# EAGLE design SV60mAHelleLEDs (EAGLE 6.5.0)
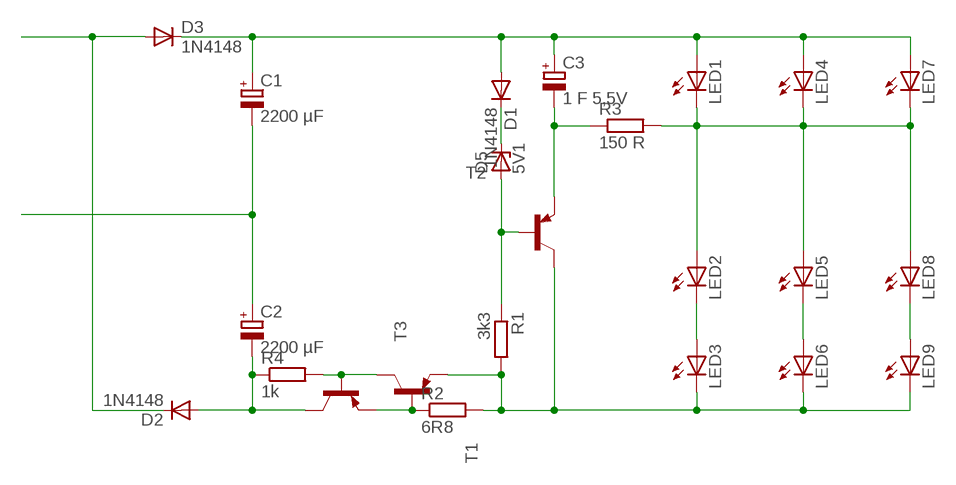
[diagram p0: schematic, sheet 1]

## Parts
C1  2200 µF  CPOL-EUE5-10.5  [E5-10,5]
C2  2200 µF  CPOL-EUE5-10.5  [E5-10,5]
C3  1 F 5,5V  CPOL-EUE3.5-10  [E3,5-10]
D1  1N4148  1N4148DO35-10  [DO35-10]
D2  1N4148  1N4148DO35-10  [DO35-10]
D3  1N4148  1N4148DO35-10  [DO35-10]
D5  5V1  BZD23  [SOD81]
LED1  LED5MM  [LED5MM]
LED2  LED5MM  [LED5MM]
LED3  LED5MM  [LED5MM]
LED4  LED5MM  [LED5MM]
LED5  LED5MM  [LED5MM]
LED6  LED5MM  [LED5MM]
LED7  LED5MM  [LED5MM]
LED8  LED5MM  [LED5MM]
LED9  LED5MM  [LED5MM]
R1  3k3  R-EU_0207/10  [0207/10]
R2  6R8  R-EU_0207/10  [0207/10]
R3  150 R  R-EU_0207/10  [0207/10]
R4  1k  R-EU_0207/10  [0207/10]
T1  2N2907-PNP-TO18-EBC  [TO18]
T2  2N2907-PNP-TO18-EBC  [TO18]
T3  2N2907-PNP-TO18-EBC  [TO18]

## Nets
D1: D2.C D3.A
D2: C1.- C2.+
LV2: LED3.K(C) LED6.K(C) LED9.K(C) R1.2 R2.2 T1.1(E) T2.3(C)
N$1: C1.+ C3.+ D1.A D3.C LED1.A LED4.A LED7.A
N$2: C2.- D2.A R4.1 T3.3(C)
N$3: R2.1 T1.2(B) T3.1(E)
N$4: R4.2 T1.3(C) T3.2(B)
N$5: D5.A R1.1 T2.2(B)
N$6: D1.C D5.C
N$7: C3.- R3.1 T2.1(E)
N$9: LED5.K(C) LED6.A
N$10: LED1.K(C) LED2.A LED4.K(C) LED5.A LED7.K(C) LED8.A R3.2
N$11: LED2.K(C) LED3.A
N$16: LED8.K(C) LED9.A

## Library data of the parts
C1-C3 = rcl:CPOL-EU: POLARIZED CAPACITOR, European symbol
D1-D3 = diode:1N4148: DIODE high speed (Philips)
D5 = diode:BZD23: Z DIODE
LED1-LED9 = led:LED: LED OSRAM: - CHIPLED LG R971, LG N971, LY N971, LG Q971, LY Q971, LO R971, LY R971 LH N974, LH R974 LS Q976, LO Q976, LY Q976 LO Q996 - Hyper CHIPLED LW Q18S LB Q993, LB Q99A, LB R99A - SideLED LS A670, LO A670, LY A670, LG A670, LP A670 LB A673, LV A673, LT A673, LW A673 LH A674 LY A675 LS A676, LA A676, LO A676, LY A676, LW A676 LS A679, LY A679, LG A679 - Hyper Micro SIDELED® LS Y876, LA Y876, LO Y876, LY Y876 LT Y87S - SmartLED LW L88C, LW L88S LB L89C, LB L89S, LG L890 LS L89K, LO L89K, LY L89K LS L896, LA L896, LO L896, LY L896 - TOPLED LS T670, LO T670, LY T670, LG T670, LP T670 LSG T670, LSP T670, LSY T670, LOP T670, LYG T670 LG T671, LOG T671, LSG T671 LB T673, LV T673, LT T673, LW T673 LH T674 LS T676, LA T676, LO T676, LY T676, LB T676, LH T676, LSB T676, LW T676 LB T67C, LV T67C, LT T67C, LS T67K, LO T67K, LY T67K, LW E67C LS E67B, LA E67B, LO E67B, LY E67B, LB E67C, LV E67C, LT E67C LW T67C LS T679, LY T679, LG T679 LS T770, LO T770, LY T770, LG T770, LP T770 LB T773, LV T773, LT T773, LW T773 LH T774 LS E675, LA E675, LY E675, LS T675 LS T776, LA T776, LO T776, LY T776, LB T776 LHGB T686 LT T68C, LB T68C - Hyper Mini TOPLED® LB M676 - Mini TOPLED Santana® LG M470 LS M47K, LO M47K, LY M47K Source: http://www.osram.convergy.de LUXEON: - LUMILED® LXK2-PW12-R00, LXK2-PW12-S00, LXK2-PW14-U00, LXK2-PW14-V00 LXK2-PM12-R00, LXK2-PM12-S00, LXK2-PM14-U00 LXK2-PE12-Q00, LXK2-PE12-R00, LXK2-PE12-S00, LXK2-PE14-T00, LXK2-PE14-U00 LXK2-PB12-K00, LXK2-PB12-L00, LXK2-PB12-M00, LXK2-PB14-N00, LXK2-PB14-P00, LXK2-PB14-Q00 LXK2-PR12-L00, LXK2-PR12-M00, LXK2-PR14-Q00, LXK2-PR14-R00 LXK2-PD12-Q00, LXK2-PD12-R00, LXK2-PD12-S00 LXK2-PH12-R00, LXK2-PH12-S00 LXK2-PL12-P00, LXK2-PL12-Q00, LXK2-PL12-R00 Source: www.luxeon.com KINGBRIGHT: KA-3528ASYC Source: www.kingbright.com
R1-R4 = rcl:R-EU_: RESISTOR, European symbol
T1-T3 = transistor:*-PNP-: PNP Transistror

## Board
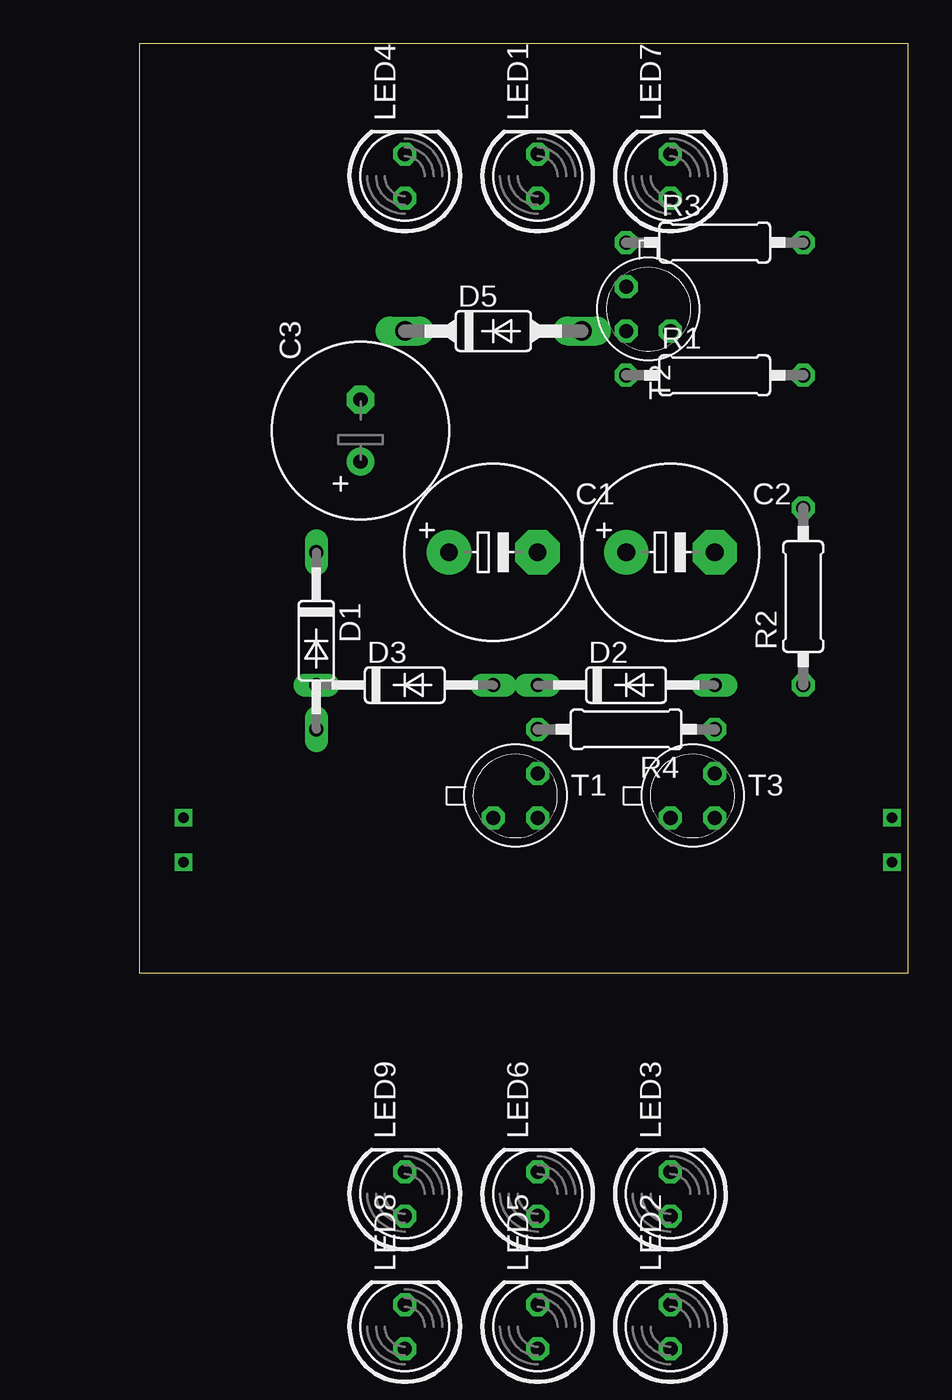
[diagram p1: board, top side]
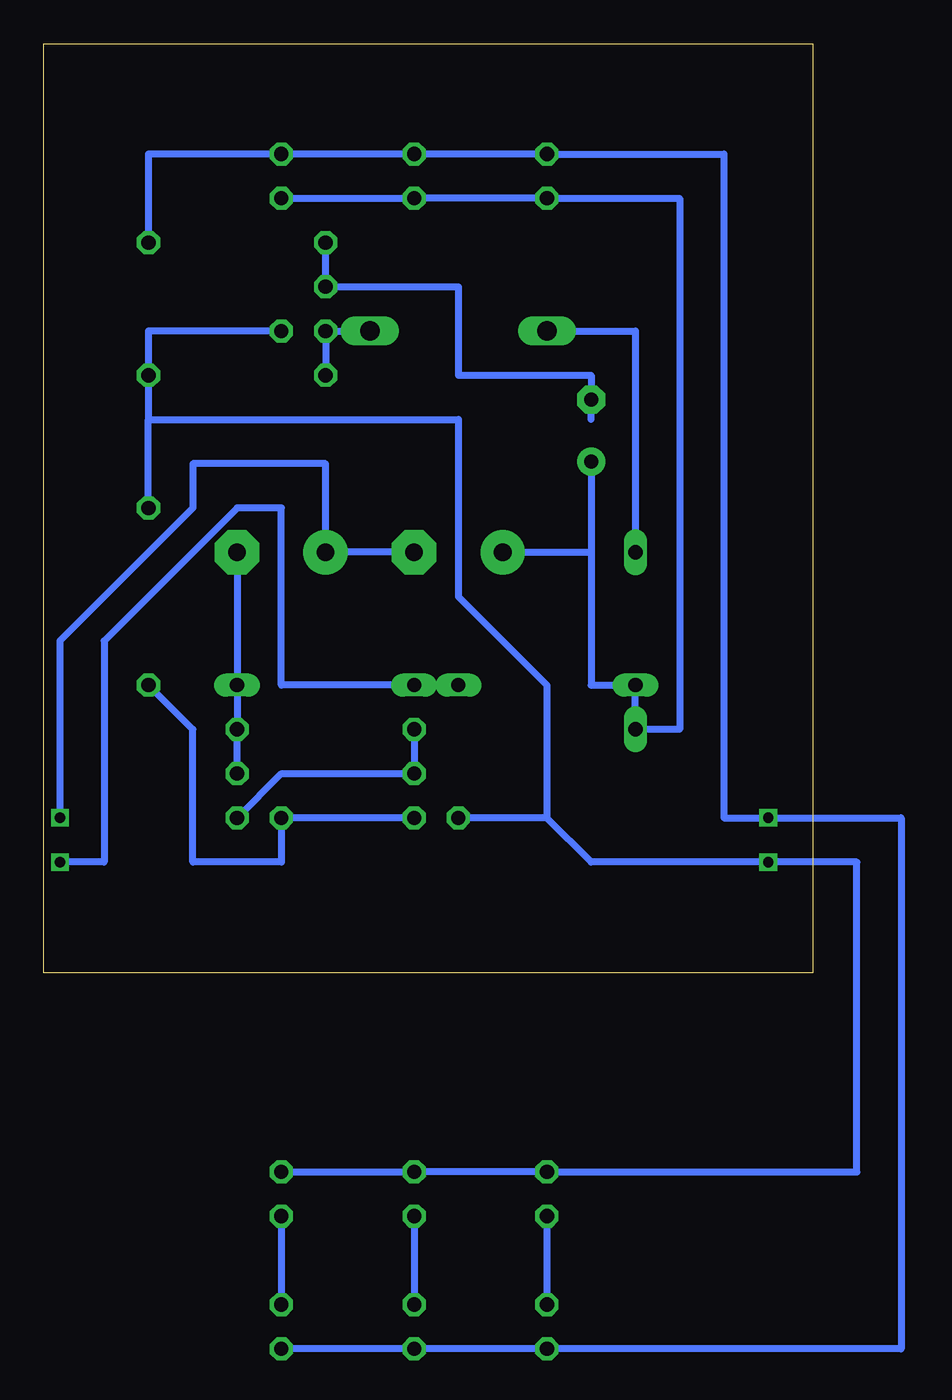
[diagram p2: board, bottom side, seen from below]

Size 44.12 x 53.33 mm. Coordinates in mm from the lower left corner, seen from the top.
Outline: 0,0 44.12,0 44.12,53.33 0,53.33 0,0
Copper layers (1*16): Top 0.035mm / dielectric 1.5mm / Bottom 0.035mm
Design rules "default": minimum track width 10mil, minimum drill 24mil, track to track 8mil, track to pad 8mil, pad to pad 8mil, via to via 8mil, smd to smd 8mil, copper to edge 40mil, drill to drill 8mil, minimum pad ring 10mil, minimum via ring 8mil, stop-mask expansion 4mil, vias tented up to drill 0mil, thermal gap 10mil
bKeepout: area 0,11.4 to 4.4,53.3; area 40,11.4 to 44.5,53.3; area 0,0 to 4.4,5.1; area 40,0 to 44.5,5.1; area 4.3,0 to 39.9,2.5

### Footprints (pad centres in the part's own frame; a part is rotated, then mirrored left to right if it is on the bottom)
E5-10,5 = drill 1.016 pad 2.54: + -2.54,0 | drill 1.016 pad 2.54 octagon: - 2.54,0
E3,5-10 = drill 0.813 pad 1.6: + -1.778,0 | drill 0.813 pad 1.6 octagon: - 1.778,0
DO35-10 = drill 0.813 long: A 5.08,0; C -5.08,0
SOD81 = drill 1.118 long: A 5.08,0; C -5.08,0
LED5MM = drill 0.813 octagon: A -1.27,0; K 1.27,0
0207/10 = drill 0.813 octagon: 1 -5.08,0; 2 5.08,0
TO18 = drill 0.813 octagon: 1 -1.27,-1.27; 2 1.27,-1.27; 3 1.27,1.27

### Placement (x,y rotation side)
C1  20.32,24.13 0 top
C2  30.48,24.13 0 top
C3  12.7,31.11 90 top
D1  10.16,19.05 270 top
D2  27.94,16.51 0 top
D3  15.24,16.51 0 top
D5  20.32,36.83 0 top
LED1  22.86,45.72 90 top
LED2  30.48,-20.32 90 top  (outside the outline)
LED3  30.48,-12.7 90 top  (outside the outline)
LED4  15.24,45.72 90 top
LED5  22.86,-20.32 90 top  (outside the outline)
LED6  22.86,-12.7 90 top  (outside the outline)
LED7  30.48,45.72 90 top
LED8  15.24,-20.32 90 top  (outside the outline)
LED9  15.24,-12.7 90 top  (outside the outline)
R1  33.02,34.29 0 top
R2  38.1,21.59 90 top
R3  33.02,41.91 0 top
R4  27.94,13.97 180 top
T1  21.59,10.16 0 top
T2  29.21,38.1 270 top
T3  31.75,10.16 0 top

### Tracks (layer width: path | path; a pad name or v marks a point on that pad's centre or on a via)
D1  (via drill 0.6)
  Bottom 0.406: D3.A D2.C 30.48,16.51 30.48,26.67 33.02,26.67 40.64,19.05 40.64,6.35 v43.18,6.35
D2  (via drill 0.6)
  Bottom 0.406: C1.- C2.+ 27.94,29.21 35.56,29.21 35.56,26.67 43.18,19.05 v43.18,8.89
LV2  (via drill 0.6)
  Bottom 0.406: T2.3 38.1,36.83 R1.2 38.1,31.75 | LED3.K LED6.K LED9.K -2.54,-11.43 -2.54,6.35 v2.54,6.35 12.7,6.35 15.24,8.89 | R2.2 38.1,31.75 | 38.1,31.75 20.32,31.75 20.32,21.59 15.24,16.51 15.24,8.89 | 15.24,8.89 T1.1
N$1
  Bottom 0.406: C3.+ 12.7,24.13 | 12.7,24.13 12.7,16.51 D3.C D1.A 7.62,13.97 7.62,44.45 LED4.A LED1.A LED7.A | C1.+ 12.7,24.13
N$2
  Bottom 0.406: C2.- D2.A R4.1 T3.3
N$3
  Bottom 0.406: T1.2 T3.1 30.48,6.35 35.56,6.35 35.56,13.97 R2.1
N$4
  Bottom 0.406: R4.2 T1.3 30.48,11.43 T3.2
N$5
  Bottom 0.406: R1.1 T2.2 D5.A
N$6
  Bottom 0.406: D5.C 10.16,36.83 D1.C
N$7
  Bottom 0.406: R3.1 T2.1 20.32,39.37 20.32,34.29 12.7,34.29 C3.- 12.7,31.75
N$9
  Bottom 0.406: LED6.A LED5.K
N$10  (via drill 0.6)
  Bottom 0.406: R3.2 38.1,46.99 LED7.K LED1.K LED4.K 5.08,46.99 5.08,8.89 v2.54,8.89 -5.08,8.89 -5.08,-21.59 LED8.A LED5.A LED2.A
N$11
  Bottom 0.406: LED3.A LED2.K
N$16
  Bottom 0.406: LED9.A LED8.K